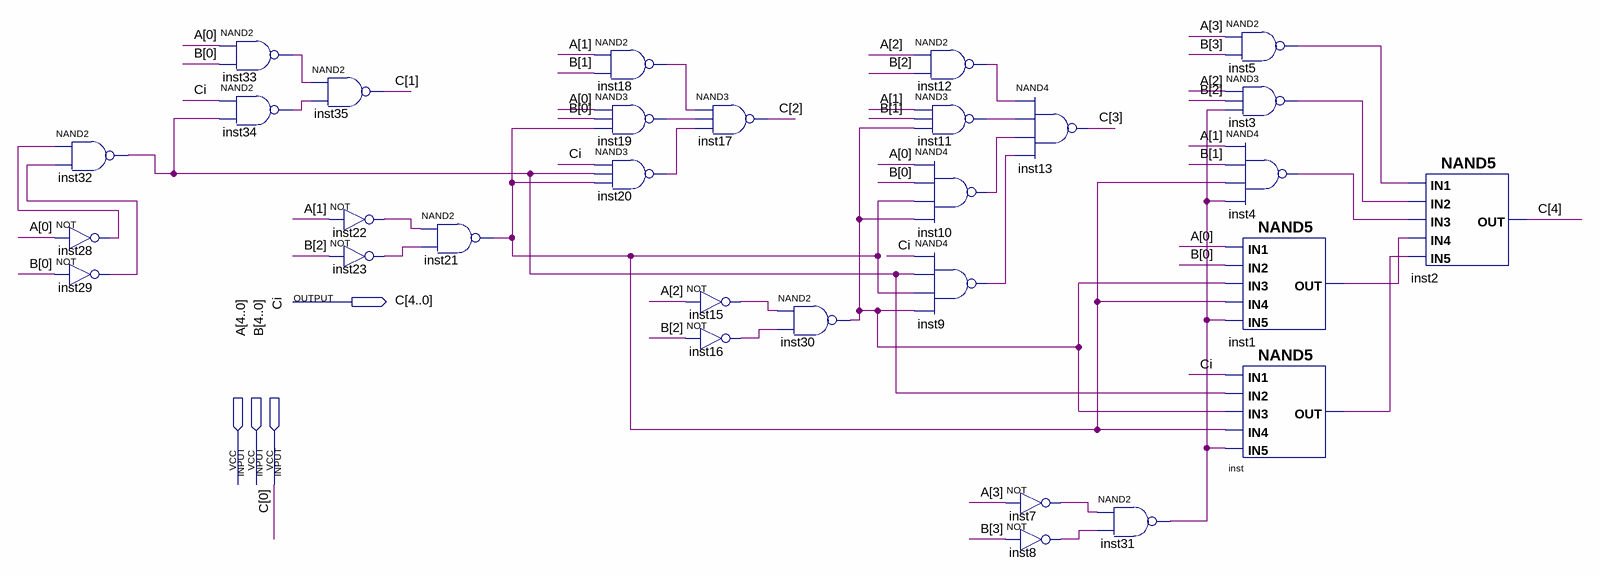
[diagram p0: schematic sheet]
// Quartus schematic perenos.bdf as structural Verilog: 30 symbols, 4 pins
module perenos (
  input  [4:0] A,
  input  [4:0] B,
  input  Ci,
  output [4:0] C
);

  wire inst1_out, inst3_out, inst4_out, inst5_out, inst7_out, inst8_out, inst9_out, inst10_out, inst11_out,
       inst12_out, inst15_out, inst16_out, inst18_out, inst19_out, inst20_out, inst21_out, inst22_out,
       inst23_out, inst28_out, inst29_out, inst30_out, inst31_out, inst32_out, inst33_out, inst34_out,
       inst_out;

  nand inst32 (inst32_out, inst28_out, inst29_out);
  not inst28 (inst28_out, A[0]);
  not inst29 (inst29_out, B[0]);
  nand inst33 (inst33_out, A[0], B[0]);
  nand inst34 (inst34_out, Ci, inst32_out);
  nand inst35 (C[1], inst33_out, inst34_out);
  not inst22 (inst22_out, A[1]);
  not inst23 (inst23_out, B[2]);
  nand inst21 (inst21_out, inst22_out, inst23_out);
  nand inst18 (inst18_out, A[1], B[1]);
  nand inst19 (inst19_out, A[0], B[0], inst21_out);
  nand inst20 (inst20_out, Ci, inst32_out, inst21_out);
  not inst15 (inst15_out, A[2]);
  not inst16 (inst16_out, B[2]);
  nand inst17 (C[2], inst18_out, inst19_out, inst20_out);
  nand inst30 (inst30_out, inst15_out, inst16_out);
  nand inst12 (inst12_out, A[2], B[2]);
  nand inst11 (inst11_out, A[1], B[1], inst30_out);
  nand inst10 (inst10_out, A[0], B[0], inst21_out, inst30_out);
  nand inst9 (inst9_out, Ci, inst32_out, inst21_out, inst30_out);
  nand inst13 (C[3], inst12_out, inst11_out, inst10_out, inst9_out);
  not inst7 (inst7_out, A[3]);
  not inst8 (inst8_out, B[3]);
  nand inst31 (inst31_out, inst7_out, inst8_out);
  nand inst5 (inst5_out, A[3], B[3]);
  nand inst3 (inst3_out, A[2], B[2], inst31_out);
  nand inst4 (inst4_out, A[1], B[1], inst21_out, inst31_out);
  nand inst1 (inst1_out, A[0], B[0], inst30_out, inst21_out, inst31_out);
  nand inst (inst_out, Ci, inst32_out, inst30_out, inst21_out, inst31_out);
  nand inst2 (C[4], inst5_out, inst3_out, inst4_out, inst1_out, inst_out);

  assign C[0] = Ci;
endmodule
